# Altium project 110-00315-D_B1-DevKit_1.PrjPcb (part 1 of 5)
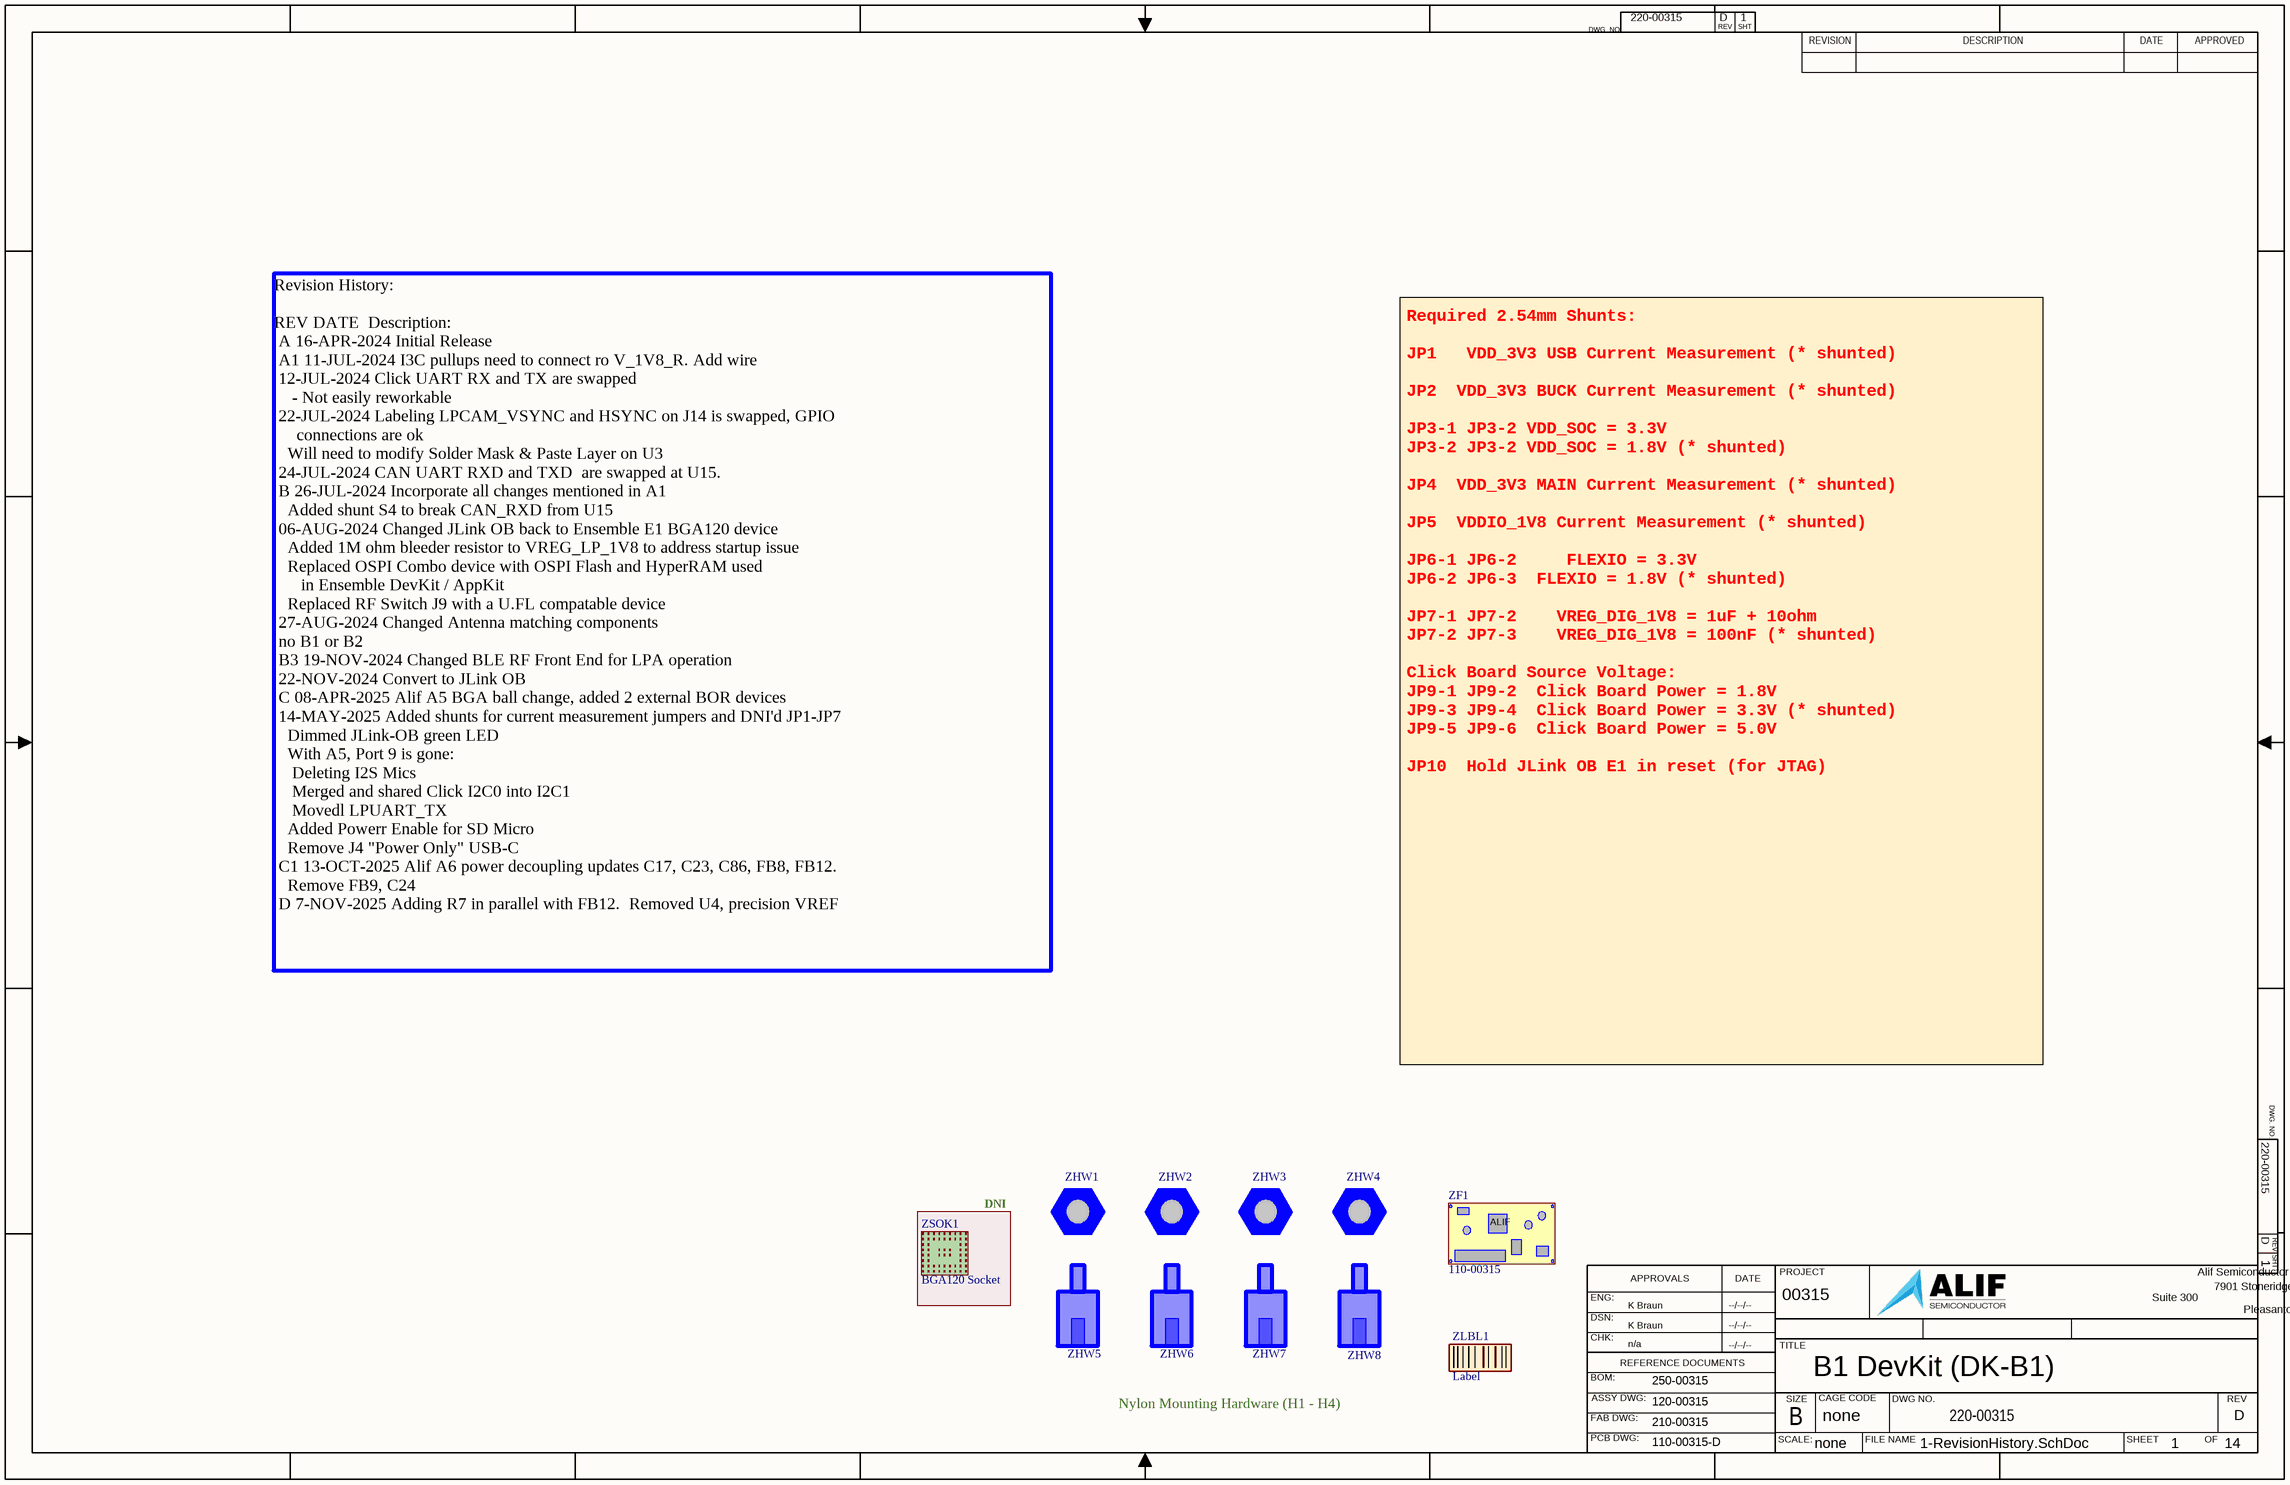
[diagram p0: 1-RevisionHistory.SchDoc]
ASSY_DWG_NO: 120-00315-D; CAGE_CODE: none; CheckedBy: n/a; CHK_APP_DATE: 11/09/25; DOC_NO_ASSY_DWG: 120-00315; DOC_NO_BOM: 250-00315; DOC_NO_FAB_DWG: 210-00315; DOC_NO_SCH_DWG: 220-00315; DOC_REV: D; DrawnBy: K Braun; DSN_APP_DATE: 11/09/25; ENG_APP_DATE: 11/09/25; Engineer: K Braun; Fab_DWG_NO: 110-00315; Marketing Name: DK-B1; Name-Company: ALIF SEMICONDUCTOR; Name-Project: B1 DevKit (DK-B1); PCB_DWG_NO: 110-00315-D; PROJECT: 00315; Revision: D; SheetTotal: 14; title: B1 DevKit (DK-B1)
14 sheets, 430 parts. Net scope: flat (ports and power ports of the same name join across sheets).
Board file: 110-00315-D_B1-DevKit.PcbDoc
Sheets:
  1-RevisionHistory.SchDoc
  2-PowerInput.SchDoc
  3-CPUPower.SchDoc
  4-CPUMipiXo.SchDoc
  5-Memory.SchDoc
  6-CODEC.SchDoc
  7-IO_Headers.SchDoc
  8-SensorsAndJTAG.SchDoc
  9-MIPI.SchDoc
  10-Click.SchDoc
  11-CPU_GPIO.SchDoc
  12-JLINK_1.SchDoc
  13-JLINK_2.SchDoc
  14-Cypress.SchDoc

## Sheet 1-RevisionHistory.SchDoc: B1 DevKit (DK-B1)
size 431 x 279 mm; Organization: ORGANIZATION; Address1: ADDRESS 1; Address2: ADDRESS 2; Address3: ADDRESS 3; Address4: ADDRESS 4; DocumentNumber: 1; Revision: -; SheetNumber: 1; SheetTotal: 14; ENG_APP_DATE: --/--/--; DSN_APP_DATE: --/--/--; CHK_APP_DATE: --/--/--

### Parts
ZF1  110-00315  (mechanical)
ZHW1  #4-40  (value not drawn)  (mechanical)
ZHW2  #4-40  (value not drawn)  (mechanical)
ZHW3  #4-40  (value not drawn)  (mechanical)
ZHW4  #4-40  (value not drawn)  (mechanical)
ZHW5  #4-40 1/4"  (value not drawn)  (mechanical)
ZHW6  #4-40 1/4"  (value not drawn)  (mechanical)
ZHW7  #4-40 1/4"  (value not drawn)  (mechanical)
ZHW8  #4-40 1/4"  (value not drawn)  (mechanical)
ZLBL1  Label  (mechanical)
ZSOK1  BGA120 Socket  (mechanical)

### Blocks framed on the sheet
DNI: ZSOK1

### Notes on the sheet
- Revision History:
  REV	DATE		Description:
  A	16-APR-2024	Initial Release
  A1	11-JUL-2024	I3C pullups need to connect ro V_1V8_R. Add wire
  12-JUL-2024	Click UART RX and TX are swapped
  - Not easily reworkable
  22-JUL-2024	Labeling LPCAM_VSYNC and HSYNC on J14 is swapped, GPIO
  connections are ok
  Will need to modify Solder Mask & Paste Layer on U3
  24-JUL-2024	CAN UART RXD and TXD  are swapped at U15.
  B	26-JUL-2024	Incorporate all changes mentioned in A1
  Added shunt S4 to break CAN_RXD from U15
  06-AUG-2024	Changed JLink OB back to Ensemble E1 BGA120 device
  Added 1M ohm bleeder resistor to VREG_LP_1V8 to address startup issue
  Replaced OSPI Combo device with OSPI Flash and HyperRAM used
  in Ensemble DevKit / AppKit
  Replaced RF Switch J9 with a U.FL compatable device
  27-AUG-2024	Changed Antenna matching components
  no B1 or B2
  B3	19-NOV-2024	Changed BLE RF Front End for LPA operation
  22-NOV-2024	Convert to JLink OB
  C	08-APR-2025	Alif A5 BGA ball change, added 2 external BOR devices
  14-MAY-2025	Added shunts for current measurement jumpers and DNI'd JP1-JP7
  Dimmed JLink-OB green LED
  With A5, Port 9 is gone:
  Deleting I2S Mics
  Merged and shared Click I2C0 into I2C1
  Movedl LPUART_TX
  Added Powerr Enable for SD Micro
  Remove J4 "Power Only" USB-C
  C1	13-OCT-2025	Alif A6 power decoupling updates C17, C23, C86, FB8, FB12.
  Remove FB9, C24
  D	7-NOV-2025	Adding R7 in parallel with FB12.  Removed U4, precision VREF
- Required 2.54mm Shunts:
  JP1 		VDD_3V3 USB Current Measurement (* shunted)
  JP2		VDD_3V3 BUCK Current Measurement (* shunted)
  JP3-1 JP3-2	VDD_SOC = 3.3V
  JP3-2 JP3-2	VDD_SOC = 1.8V (* shunted)
  JP4		VDD_3V3 MAIN Current Measurement (* shunted)
  JP5		VDDIO_1V8 Current Measurement (* shunted)
  JP6-1 JP6-2     FLEXIO = 3.3V
  JP6-2 JP6-3 	FLEXIO = 1.8V (* shunted)
  JP7-1 JP7-2   	VREG_DIG_1V8 = 1uF + 10ohm
  JP7-2 JP7-3   	VREG_DIG_1V8 = 100nF (* shunted)
  Click Board Source Voltage:
  JP9-1 JP9-2 	Click Board Power = 1.8V
  JP9-3 JP9-4 	Click Board Power = 3.3V (* shunted)
  JP9-5 JP9-6 	Click Board Power = 5.0V
  JP10		Hold JLink OB E1 in reset (for JTAG)
- Nylon Mounting Hardware (H1 - H4)
- DWG. NO.
- REV
- SHT
- REVISION
- DESCRIPTION
- DATE
- APPROVED
- ENG:
- APPROVALS
- PROJECT
- Suite 300
- Alif Semiconductor
- 7901 Stoneridge Drive
- DSN:
- CHK:
- REFERENCE DOCUMENTS
- TITLE
- Pleasanton, CA 94588  USA
- BOM:
- FAB DWG:
- PCB DWG:
- ASSY DWG:
- SCALE:
- SIZE
- B
- CAGE CODE
- FILE NAME
- DWG NO.
- SHEET
- OF
- none
- (in symbol PCB_FAB) ALIF

### Library data of the parts
ZF1 = PCB_FAB: Printed Circuit Board  Fabrication; Manufacturer 1: Alif Semi; Manufacturer Part Number 1: 110-00315-D; Manufacturer 2: *; Manufacturer Part Number 2: *; Manufacturer 3: *; Manufacturer Part Number 3: *
ZHW1-ZHW4 = HW_NUT: Hardware, Nut, Hex, #4-40 x 1/8" H, 1/4" Dia, Nylon; Manufacturer 1: Essentra Comp; Manufacturer Part Number 1: 0400440HNS; Manufacturer 2: *; Manufacturer Part Number 2: *; Manufacturer 3: *; Manufacturer Part Number 3: *
ZHW5-ZHW8 = HW_STANDOFF_MF: Hardware, Standoff, Hex Male-Female, #4-40 x 1/4" H, 1/4" Dia, Nylon; Manufacturer 1: Keystone; Manufacturer Part Number 1: 4800; Manufacturer 2: Essentra Comp; Manufacturer Part Number 2: 36440MF025; Manufacturer 3: RAF Elec; Manufacturer Part Number 3: 4530-440-N
ZLBL1 = MOD_LABEL_GENERIC: Label, UPC, Agency and Lot Num, Low Cost Balletto DevKit; Manufacturer 1: Alif; Manufacturer Part Number 1: -need a p/n-; Manufacturer 2: *; Manufacturer Part Number 2: *; Manufacturer 3: *; Manufacturer Part Number 3: *
ZSOK1 = MOD_SOCKET: DNI, Socket, IC Test, BGA120; Manufacturer 1: TwinSocket; Manufacturer Part Number 1: TIUI2050-00120-01; Manufacturer 2: *; Manufacturer Part Number 2: *; Manufacturer 3: *; Manufacturer Part Number 3: *

## Sheet 2-PowerInput.SchDoc: B1 DevKit (DK-B1)
size 431 x 279 mm; Organization: ORGANIZATION; Address1: ADDRESS 1; Address2: ADDRESS 2; Address3: ADDRESS 3; Address4: ADDRESS 4; DocumentNumber: 2; Revision: -; SheetNumber: 2; SheetTotal: 14; ENG_APP_DATE: --/--/--; DSN_APP_DATE: --/--/--; CHK_APP_DATE: --/--/--
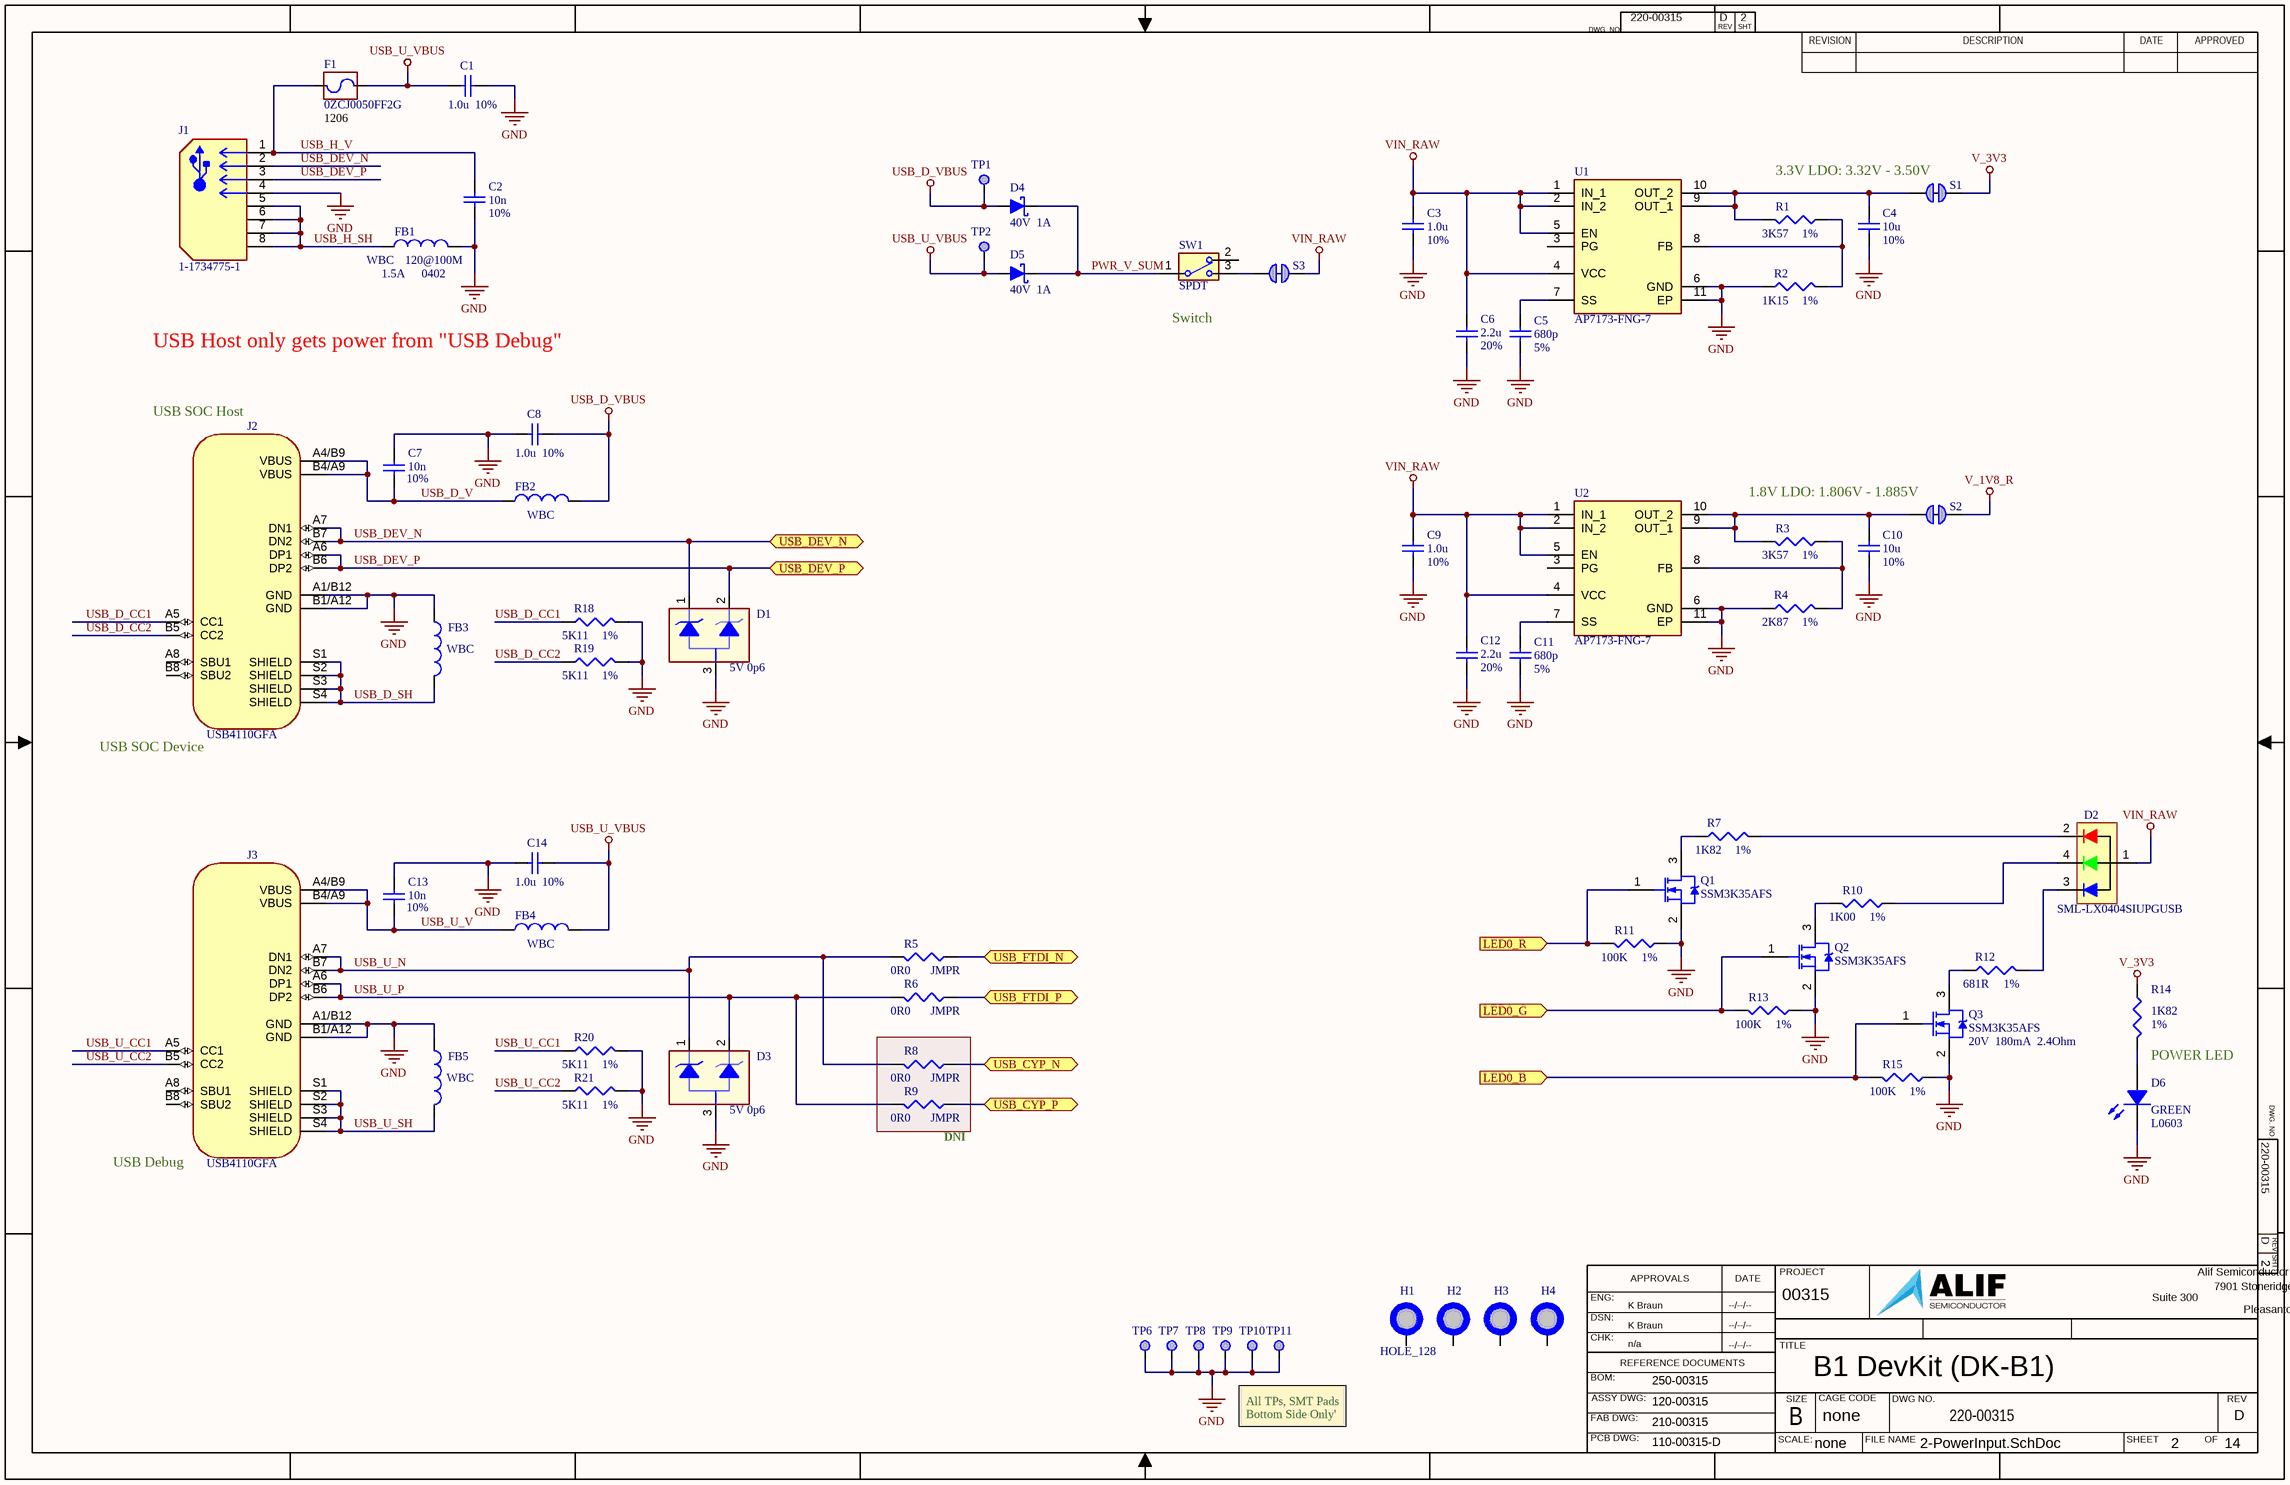
[diagram p1: 2-PowerInput.SchDoc]

### Parts
C1  value 1.0u  Tolerance: 10%  [CAPC0402-01]  (hidden comment: Cap)
C2  value 10n  Tolerance: 10%  [CAPC0402-01]  (hidden comment: Cap)
C3  value 1.0u  Tolerance: 10%  [CAPC0402-01]  (hidden comment: Cap)
C4  value 10u  Tolerance: 10%  [CAPC0402-01]  (hidden comment: Cap)
C5  value 680p  Tolerance: 5%  [CAPC0402-01]  (hidden comment: Cap)
C6  value 2.2u  Tolerance: 20%  [CAPC0402-01]  (hidden comment: Cap_225M25VX5R0402_1)
C7  value 10n  Tolerance: 10%  [CAPC0402-01]  (hidden comment: Cap)
C8  value 1.0u  Tolerance: 10%  [CAPC0402-01]  (hidden comment: Cap)
C9  value 1.0u  Tolerance: 10%  [CAPC0402-01]  (hidden comment: Cap)
C10  value 10u  Tolerance: 10%  [CAPC0402-01]  (hidden comment: Cap)
C11  value 680p  Tolerance: 5%  [CAPC0402-01]  (hidden comment: Cap)
C12  value 2.2u  Tolerance: 20%  [CAPC0402-01]  (hidden comment: Cap_225M25VX5R0402_1)
C13  value 10n  Tolerance: 10%  [CAPC0402-01]  (hidden comment: Cap)
C14  value 1.0u  Tolerance: 10%  [CAPC0402-01]  (hidden comment: Cap)
D1  value 5V 0p6  [SOT-23_DBZ_TEX]  (hidden comment: Zener)
D2  SML-LX0404SIUPGUSB  [LED_SML-LX0404_LUM]
D3  value 5V 0p6  [SOT-23_DBZ_TEX]  (hidden comment: Zener)
D4  value 40V  1A  [SOD123F_NXP]  (hidden comment: D Schottky)
D5  value 40V  1A  [SOD123F_NXP]  (hidden comment: D Schottky)
D6  value GREEN  PackageReference: L0603  [LED_0603-GRN_AK]  (hidden comment: D LED2)
F1  0ZCJ0050FF2G  Footprint: 1206  [RESC3216X125N_1206]
FB1  value WBC  Impedance: 120@100M  PCB_Footprint: 0402  RMS_Current: 1.5A  [FB_0402_MuRata_as_R0402]  (hidden comment: Ind_WBC_1A5_120@100M0402_1)
FB2  value WBC  [FB_0402_MuRata_as_R0402]  (hidden comment: Ind_WBC_1A5_120@100M0402_1)
FB3  value WBC  [FB_0402_MuRata_as_R0402]  (hidden comment: Ind_WBC_1A5_120@100M0402_1)
FB4  value WBC  [FB_0402_MuRata_as_R0402]  (hidden comment: Ind_WBC_1A5_120@100M0402_1)
FB5  value WBC  [FB_0402_MuRata_as_R0402]  (hidden comment: Ind_WBC_1A5_120@100M0402_1)
H1  HOLE_128  [Hole_#4]  (no BOM)
H2  HOLE_128  [Hole_#4]  (value not drawn)  (no BOM)
H3  HOLE_128  [Hole_#4]  (value not drawn)  (no BOM)
H4  HOLE_128  [Hole_#4]  (value not drawn)  (no BOM)
J1  1-1734775-1  [614004134726]
J2  USB4110GFA  [CONN_USB_C_GCT_USB4110GFA]
J3  USB4110GFA  [CONN_USB_C_GCT_USB4110GFA]
Q1  Manufacturer Part Number 1: SSM3K35AFS  [SC75_SSM_TOS-L]  (hidden comment: NMOS-2_SOT)
Q2  Manufacturer Part Number 1: SSM3K35AFS  [SC75_SSM_TOS-L]  (hidden comment: NMOS-2_SOT)
Q3  value 20V  180mA  2.4Ohm  Manufacturer Part Number 1: SSM3K35AFS  [SC75_SSM_TOS-L]  (hidden comment: NMOS-2_SOT)
R1  value 3K57  Tolerance: 1%  [RESC0402-01]  (hidden comment: Res3)
R2  value 1K15  Tolerance: 1%  [RESC0402-01]  (hidden comment: Res3)
R3  value 3K57  Tolerance: 1%  [RESC0402-01]  (hidden comment: Res3)
R4  value 2K87  Tolerance: 1%  [RESC0402-01]  (hidden comment: Res3)
R5  value 0R0  Tolerance: JMPR  [RESC0402-01]  (hidden comment: Res3)
R6  value 0R0  Tolerance: JMPR  [RESC0402-01]  (hidden comment: Res3)
R7  value 1K82  Tolerance: 1%  [RESC0402-01]  (hidden comment: Res3)
R8  value 0R0  Tolerance: JMPR  [RESC0402-01]  (hidden comment: Res3)
R9  value 0R0  Tolerance: JMPR  [RESC0402-01]  (hidden comment: Res3)
R10  value 1K00  Tolerance: 1%  [RESC0402-01]  (hidden comment: Res3)
R11  value 100K  Tolerance: 1%  [RESC0402-01]  (hidden comment: Res3)
R12  value 681R  Tolerance: 1%  [RESC0402-01]  (hidden comment: Res3)
R13  value 100K  Tolerance: 1%  [RESC0402-01]  (hidden comment: Res3)
R14  value 1K82  Tolerance: 1%  [RESC0402-01]  (hidden comment: Res3)
R15  value 100K  Tolerance: 1%  [RESC0402-01]  (hidden comment: Res3)
R18  value 5K11  Tolerance: 1%  [RESC0402-01]  (hidden comment: Res3)
R19  value 5K11  Tolerance: 1%  [RESC0402-01]  (hidden comment: Res3)
R20  value 5K11  Tolerance: 1%  [RESC0402-01]  (hidden comment: Res3)
R21  value 5K11  Tolerance: 1%  [RESC0402-01]  (hidden comment: Res3)
S1  SolderJumperShorted_Small  [Solderbridge_Shorted]  (value not drawn)  (net tie, no BOM)
S2  SolderJumperShorted_Small  [Solderbridge_Shorted]  (value not drawn)  (net tie, no BOM)
S3  SolderJumperShorted_Small  [Solderbridge_Shorted]  (value not drawn)  (net tie, no BOM)
SW1  SPDT  [SW_450301014042_WRE]
TP1  TP_SMPAD  [TP_30_RND]  (value not drawn)  (no BOM)
TP2  TP_SMPAD  [TP_30_RND]  (value not drawn)  (no BOM)
TP6  TP_SMPAD  [TP_30_RND]  (value not drawn)  (no BOM)
TP7  TP_SMPAD  [TP_30_RND]  (value not drawn)  (no BOM)
TP8  TP_SMPAD  [TP_30_RND]  (value not drawn)  (no BOM)
TP9  TP_SMPAD  [TP_30_RND]  (value not drawn)  (no BOM)
TP10  TP_SMPAD  [TP_30_RND]  (value not drawn)  (no BOM)
TP11  TP_SMPAD  [TP_30_RND]  (value not drawn)  (no BOM)
U1  AP7173-FNG-7  [UDFN3030-10_SON50P300X300X63-11N]
U2  AP7173-FNG-7  [UDFN3030-10_SON50P300X300X63-11N]

### Ports
LED0_B (in), LED0_G (in), LED0_R (in), USB_CYP_N (bidir), USB_CYP_P (bidir), USB_DEV_N (bidir), USB_DEV_P (bidir), USB_FTDI_N (bidir), USB_FTDI_P (bidir)

### Nets
GND: C1.2 C2.1 C3.1 C4.1 C5.1 C6.1 C7.1 C8.1 C9.1 C10.1 C11.1 C12.1 C13.1 C14.1 D1.3(A) D3.3(A) D6.K FB1.2 FB3.1 FB5.1 J1.4 J2.A1/B12(GND) J2.B1/A12(GND) J3.A1/B12(GND) J3.B1/A12(GND) Q1.2(S) Q2.2(S) Q3.2(S) R2.1 R4.1 R11.1 R13.1 R15.1 R18.2 R19.2 R20.2 R21.2 TP6.1 TP7.1 TP8.1 TP9.1 TP10.1 TP11.1 U1.6(GND) U1.11(EP) U2.6(GND) U2.11(EP)
USB_D_VBUS: C8.2 D4.2(A) FB2.2 TP1.1
USB_U_VBUS: C1.1 C14.2 D5.2(A) F1.2 FB4.2 TP2.1
V_1V8_R: S2.2
V_3V3: R14.1 S1.2
VIN_RAW: C3.2 C6.2 C9.2 C12.2 D2.1(A) S3.2 U1.1(IN_1) U1.2(IN_2) U1.4(VCC) U1.5(EN) U2.1(IN_1) U2.2(IN_2) U2.4(VCC) U2.5(EN)
P4_3: Q3.1(G) R15.2 ; port LED0_B
P4_5: Q2.1(G) R13.2 ; port LED0_G
P4_7: Q1.1(G) R11.2 ; port LED0_R
PWR_V_SUM: D4.1(K) D5.1(K) SW1.1(COMMON)
USB_CYP_N: R8.1 ; port USB_CYP_N
USB_CYP_P: R9.1 ; port USB_CYP_P
USB_D_CC1: J2.A5(CC1) R18.1
USB_D_CC2: J2.B5(CC2) R19.1
USB_D_SH: FB3.2 J2.S1(SHIELD) J2.S2(SHIELD) J2.S3(SHIELD) J2.S4(SHIELD)
USB_D_V: C7.2 FB2.1 J2.A4/B9(VBUS) J2.B4/A9(VBUS)
USB_DEV_N: D1.1(K1) J1.2 J2.A7(DN1) J2.B7(DN2) ; port USB_DEV_N
USB_DEV_P: D1.2 J1.3 J2.A6(DP1) J2.B6(DP2) ; port USB_DEV_P
USB_FTDI_N: R5.1 ; port USB_FTDI_N
USB_FTDI_P: R6.1 ; port USB_FTDI_P
USB_H_SH: FB1.1 J1.5 J1.6 J1.7 J1.8
USB_H_V: C2.2 F1.1 J1.1
USB_U_CC1: J3.A5(CC1) R20.1
USB_U_CC2: J3.B5(CC2) R21.1
USB_U_N: D3.1(K1) J3.A7(DN1) J3.B7(DN2) R5.2 R8.2
USB_U_P: D3.2 J3.A6(DP1) J3.B6(DP2) R6.2 R9.2
USB_U_SH: FB5.2 J3.S1(SHIELD) J3.S2(SHIELD) J3.S3(SHIELD) J3.S4(SHIELD)
USB_U_V: C13.2 FB4.1 J3.A4/B9(VBUS) J3.B4/A9(VBUS)
NetC4_2: C4.2 R1.2 S1.1 U1.9(OUT_1) U1.10(OUT_2)
NetC5_2: C5.2 U1.7(SS)
NetC10_2: C10.2 R3.2 S2.1 U2.9(OUT_1) U2.10(OUT_2)
NetC11_2: C11.2 U2.7(SS)
NetD2_2: D2.2(RK) R7.2
NetD2_3: D2.3(BK) R12.2
NetD2_4: D2.4(GK) R10.1
NetD6_A: D6.A R14.2
NetQ1_3: Q1.3(D) R7.1
NetQ2_3: Q2.3(D) R10.2
NetQ3_3: Q3.3(D) R12.1
NetR1_1: R1.1 R2.2 U1.8(FB)
NetR3_1: R3.1 R4.2 U2.8(FB)
NetS3_1: S3.1 SW1.3(NO)

Not connected (* = marked no-connect by the designer): H1 1; H2 1; H3 1; H4 1; J2 A8(SBU1) B8(SBU2); J3 A8(SBU1) B8(SBU2); SW1 2(NC); U1 3(PG); U2 3(PG)

### Notes on the sheet
- (near S1) 3.3V LDO: 3.32V - 3.50V
- USB Host only gets power from "USB Debug"
- (near SW1) Switch
- (near J2) USB SOC Host
- (near S2) 1.8V LDO: 1.806V - 1.885V
- (near J2) USB SOC Device
- (near R14) POWER LED
- (near J3) USB Debug
- (near R9) DNI
- All TPs, SMT Pads
  Bottom Side Only'
- DWG. NO.
- REV
- SHT
- REVISION
- DESCRIPTION
- DATE
- APPROVED
- ENG:
- APPROVALS
- PROJECT
- Suite 300
- Alif Semiconductor
- 7901 Stoneridge Drive
- DSN:
- CHK:
- REFERENCE DOCUMENTS
- TITLE
- Pleasanton, CA 94588  USA
- BOM:
- FAB DWG:
- PCB DWG:
- ASSY DWG:
- SCALE:
- SIZE
- B
- CAGE CODE
- FILE NAME
- DWG NO.
- SHEET
- OF
- none

### Library data of the parts
C1 C3 C8 C9 C14 = Cap: Cap,1.0uF,20%,25V,X5R,0402; Manufacturer 1: TDK; Manufacturer Part Number 1: CGB2A1X5R1E105K033BC; PCB_Footprint: CC0402; Published: 8-Jun-2000; LatestRevisionDate: 17-Jul-2002; LatestRevisionNote: Re-released for DXP Platform.; PackageReference: RAD-0.3; Publisher: Altium Limited; PackageDescription: Radial Cap, Thru-Hole; 2 Leads; 0.3 in Pin Spacing; Max_Height: 0.60mm; Manufacturer 2: Yageo; Manufacturer Part Number 2: CC0402KRX5R8BB105; Manufacturer 3: Murata; Manufacturer Part Number 3: GRM155R61E105KA12D; Type: X5R; Voltage: 25V
C2 C7 C13 = Cap: Cap,10nF,10%,50V,X7R,0402; Manufacturer 1: TDK; Manufacturer Part Number 1: CGA2B3X7R1H103K050BE; PCB_Footprint: CC0402; Published: 8-Jun-2000; LatestRevisionDate: 17-Jul-2002; LatestRevisionNote: Re-released for DXP Platform.; PackageReference: RAD-0.3; Publisher: Altium Limited; PackageDescription: Radial Cap, Thru-Hole; 2 Leads; 0.3 in Pin Spacing; Max_Height: 0.60mm; Manufacturer 2: Samsung; Manufacturer Part Number 2: CL05B103KB5NNNC; Manufacturer 3: Walsin; Manufacturer Part Number 3: 0402B103K500CT; Type: X7R; Voltage: 50V
C4 C10 = Cap: Cap,10uF,20%,10V,X5R,0402; Manufacturer 1: AVX; Manufacturer Part Number 1: 0402ZD106MAT2A; PCB_Footprint: CC0402; Published: 8-Jun-2000; LatestRevisionDate: 17-Jul-2002; LatestRevisionNote: Re-released for DXP Platform.; PackageReference: RAD-0.3; Publisher: Altium Limited; PackageDescription: Radial Cap, Thru-Hole; 2 Leads; 0.3 in Pin Spacing; Max_Height: 0.60mm; Manufacturer 2: Samsung; Manufacturer Part Number 2: CL05A106MP5NUNC; Manufacturer 3: Venkel; Manufacturer Part Number 3: C0402X5R100-106MNP; Type: X5R; Voltage: 10V
C5 C11 = Cap: Cap,680pF,5%,50V,C0G,0402; Manufacturer 1: TDK; Manufacturer Part Number 1: CGA2B2NP01H681J050BA; PCB_Footprint: CC0402; Published: 8-Jun-2000; LatestRevisionDate: 17-Jul-2002; LatestRevisionNote: Re-released for DXP Platform.; PackageReference: RAD-0.3; Publisher: Altium Limited; PackageDescription: Radial Cap, Thru-Hole; 2 Leads; 0.3 in Pin Spacing; Max_Height: 0.60mm; Manufacturer 2: Samsung; Manufacturer Part Number 2: CL05C681JB5NNNC; Manufacturer 3: Walsin; Manufacturer Part Number 3: 0402N681J500CT; Type: C0G; Voltage: 50V
C6 C12 = Cap_225M25VX5R0402_1: Cap,2.2uF,20%,25V,X5R,0402; Manufacturer 1: TDK; Manufacturer Part Number 1: C1005X5R1E225M050BC; PCB_Footprint: CC0402; Published: 8-Jun-2000; LatestRevisionDate: 17-Jul-2002; LatestRevisionNote: Re-released for DXP Platform.; PackageReference: RAD-0.3; Publisher: Altium Limited; PackageDescription: Radial Cap, Thru-Hole; 2 Leads; 0.3 in Pin Spacing; Max_Height: 0.60mm; Type: X5R; Voltage: 25V; Manufacturer 2: Murata; Manufacturer Part Number 2: GRM155R61E225ME11D; Manufacturer 3: Murata; Manufacturer Part Number 3: GRM155R61E225ME15D
D1 D3 = D Zener_2_ComA: Diode,Zener,Dual,Common Anode; Manufacturer 1: Nexpheria; Manufacturer Part Number 1: PESD2USB5UX-TR; Published: 8-Jun-2000; LatestRevisionDate: 17-Jul-2002; LatestRevisionNote: Re-released for DXP Platform.; PackageReference: SOT23-3; Publisher: Altium Limited; PackageDescription: SOT23-3; Code_JEDEC: SOT23-3; Manufacturer 2: Nexpheria; Manufacturer Part Number 2: PESD2USB5UXT-QR; Manufacturer 3: *; Manufacturer Part Number 3: *
D2 = D LED_RGB_CA_1MMc1MM: Diode,LED,RGB, (@2mA) -> R=10mcd & 1.75V, G = 50mcd & 2.75V, B = 20mcd & 2.95V, 0404(1mm x 1mm); Manufacturer 1: Lumex; Published: 8-Jun-2000; LatestRevisionDate: 17-Jul-2002; LatestRevisionNote: Re-released for DXP Platform.; PackageVersion: Feb-2002; PackageReference: 1.0x1.0; Publisher: Altium Limited; PackageDescription: SM LED; 2 Flat Leads; Manufacturer Part Number 1: SML-LX0404SIUPGUSB; Manufacturer 2: *; Manufacturer Part Number 2: *; Manufacturer 3: *; Manufacturer Part Number 3: *
D4 D5 = D Schottky: Diode,Schottky,1A,40V,SOD123; Manufacturer 1: ST; Manufacturer Part Number 1: STPS140ZY; Published: 8-Jun-2000; LatestRevisionDate: 17-Jul-2002; LatestRevisionNote: Re-released for DXP Platform.; PackageReference: SOD123; Publisher: Altium Limited; PackageDescription: SOD123; Code_JEDEC: SOD123; Manufacturer 2: Panjit; Manufacturer Part Number 2: SBA140AS_R1_00001; Manufacturer 3: Nexpheria; Manufacturer Part Number 3: PMEG4010EH,115
D6 = D LED2: Diode,LED,Green 573nm,300mcd @ 20mA,0603; Manufacturer 1: Wurth; Manufacturer Part Number 1: 150060VS86000; Published: 8-Jun-2000; LatestRevisionDate: 17-Jul-2002; LatestRevisionNote: Re-released for DXP Platform.; PackageVersion: Feb-2002; Publisher: Altium Limited; PackageDescription: SM LED; 2 Flat Leads; Manufacturer 2: *; Manufacturer Part Number 2: *; Manufacturer 3: *; Manufacturer Part Number 3: *
F1 = Fuse_PTC_0ZCJ0050FF2G: Fuse,Poly PTC,1A,8V,150mOhm,1206; Mfr_Name: Belfuse; Copyright: Copyright (C) 2022 Ultra Librarian. All rights reserved.; Manufacturer_Part_Number: 0ZCJ0050FF2G; Digi-Key_Part_Number_1: 507-1802-1-ND; Digi-Key_Part_Number_2: 507-1802-2-ND; Digi-Key_Part_Number_3: 507-1802-6-ND; RefDes: RefDes; Manufacturer 1: Belfuse; Manufacturer Part Number 1: 0ZCJ0050FF2G; Manufacturer 2: *; Manufacturer Part Number 2: *; Manufacturer 3: *; Manufacturer Part Number 3: *
FB1 = Ind_WBC_1A5_120@100M0402_1: Ind,WidebandChoke,1.5A,120ohm@100MHz,95mOhm,0402; Manufacturer 1: Murata; Manufacturer Part Number 1: BLM15EG121SN1D; Code_IEC: 1005; DCR: 143m; Tolerance: 30%; Published: 8-Jun-2000; LatestRevisionDate: 29-May-2009; LatestRevisionNote: IPC-7351 Footprint Added.; PackageReference: 0402-A; Publisher: Altium Limited; PackageDescription: Chip Inductor; Code_JEITA: 0402; Sat_Current: *; Type: *; Manufacturer 2: *; Manufacturer Part Number 2: *; Manufacturer 3: *; Manufacturer Part Number 3: *; Max_Height: 0.60mm
FB2-FB5 = Ind_WBC_1A5_120@100M0402_1: Ind,WidebandChoke,1.5A,120ohm@100MHz,95mOhm,0402; Manufacturer 1: Murata; Manufacturer Part Number 1: BLM15EG121SN1D; Code_IEC: 1005; DCR: 143m; Tolerance: 30%; PCB_Footprint: 0402; Published: 8-Jun-2000; LatestRevisionDate: 29-May-2009; LatestRevisionNote: IPC-7351 Footprint Added.; PackageReference: 0402-A; Publisher: Altium Limited; PackageDescription: Chip Inductor; Code_JEITA: 0402; Sat_Current: *; Type: *; Manufacturer 2: *; Manufacturer Part Number 2: *; Manufacturer 3: *; Manufacturer Part Number 3: *; Max_Height: 0.60mm; Impedance: 120@100M; RMS_Current: 1.5A
H1-H4 = HOLE_128: Hole, #4,--not a BOM item--; PCB_Footprint: TP_PAD1
J1 = Conn_1-1734775-1: Conn,USB 2.0, Type A Recept,4 Pos, R/A; Mfr_Name: TE Connectivity; Type: DEV; Copyright: Copyright (C) 2022 Ultra Librarian. All rights reserved.; Manufacturer_Part_Number: 1-1734775-1; Digi-Key_Part_Number_1: A108852-ND; RefDes: RefDes; Manufacturer 1: TE Connectivity; Manufacturer Part Number 1: 1-1734775-1; Manufacturer 2: *; Manufacturer Part Number 2: *; Manufacturer 3: *; Manufacturer Part Number 3: *
J2 J3 = CONN_USB_C_SMT_USB4110GFA: CONN,USB-C, USB 2.0 Receptacle Connector 24 (16+8 Dummy) Position Surface Mount, Right Angle; Manufacturer 1: GCT; SnapEDA_Link: https://www.snapeda.com/parts/USB4110GFA/Global+Connector+Technology/view-part/?ref=snap; Package: None; Value: *; Manufacturer Part Number 1: USB4110GFA; Manufacturer 2: Linkplex; Manufacturer Part Number 2: LUB-C123D-007-G-19
Q1 Q2 = NMOS-2_SOT: MOSFET,N-CH,20V,250mA,1.1Ohm,SOT-23; Manufacturer 1: Toshiba; Note: Pin 2 is electrically connected to pin 4.; Value: 20V  180mA  2.4Ohm; Published: 8-Jun-2000; LatestRevisionDate: 17-Jul-2002; LatestRevisionNote: Re-released for DXP Platform.; DatasheetVersion: PD-9.814; PackageVersion: Feb-1997; PackageReference: TO-220AB; Publisher: Altium Limited; PackageDescription: TO, Thru-Hole, Vertical, Heatsink Mounted; 3 In-Line Leads; Pitch 2.54 mm; ComponentLink1Description: Manufacturer Link; ComponentLink1URL: http://www.irf.com/; Manufacturer 2: Rohm; Manufacturer Part Number 2: RUE002N02TL; Manufacturer 3: *; Manufacturer Part Number 3: *
Q3 = NMOS-2_SOT: MOSFET,N-CH,20V,250mA,1.1Ohm,SOT-23; Manufacturer 1: Toshiba; Note: Pin 2 is electrically connected to pin 4.; Published: 8-Jun-2000; LatestRevisionDate: 17-Jul-2002; LatestRevisionNote: Re-released for DXP Platform.; DatasheetVersion: PD-9.814; PackageVersion: Feb-1997; PackageReference: TO-220AB; Publisher: Altium Limited; PackageDescription: TO, Thru-Hole, Vertical, Heatsink Mounted; 3 In-Line Leads; Pitch 2.54 mm; ComponentLink1Description: Manufacturer Link; ComponentLink1URL: http://www.irf.com/; Manufacturer 2: Rohm; Manufacturer Part Number 2: RUE002N02TL; Manufacturer 3: *; Manufacturer Part Number 3: *
R1 R3 = Res3: Res,3K57,1%,100ppm,0402; Manufacturer 1: Stackpol; Manufacturer Part Number 1: RMCF0402FT3K57; Wattage: 63mW; Published: 8-Jun-2000; LatestRevisionDate: 29-May-2009; LatestRevisionNote: IPC-7351 Footprint Added.; PackageReference: RESC0402-01; Publisher: Altium Limited; PackageDescription: Chip Resistor; Voltage: *; Type: Thick Film; Manufacturer 2: Yageo; Manufacturer Part Number 2: RC0402FR-073K57L; Manufacturer 3: *; Manufacturer Part Number 3: *; PCB_Footprint: RESC0402-01
R2 = Res3: Res,1K15,1%,100ppm,0402; Manufacturer 1: Stackpol; Manufacturer Part Number 1: RMCF0402FT1K15; Wattage: 63mW; Published: 8-Jun-2000; LatestRevisionDate: 29-May-2009; LatestRevisionNote: IPC-7351 Footprint Added.; PackageReference: RESC0402-01; Publisher: Altium Limited; PackageDescription: Chip Resistor; Voltage: *; Type: Thick Film; Manufacturer 2: Yageo; Manufacturer Part Number 2: RC0402FR-071K15L; Manufacturer 3: Bourns; Manufacturer Part Number 3: CR0402-FX-1151GLF; PCB_Footprint: RESC0402-01
R4 = Res3: Res,2K87,1%,100ppm,0402; Manufacturer 1: Stackpol; Manufacturer Part Number 1: RMCF0402FT2K87; Wattage: 63mW; Published: 8-Jun-2000; LatestRevisionDate: 29-May-2009; LatestRevisionNote: IPC-7351 Footprint Added.; PackageReference: RESC0402-01; Publisher: Altium Limited; PackageDescription: Chip Resistor; Voltage: *; Type: Thick Film; Manufacturer 2: Yageo; Manufacturer Part Number 2: RC0402FR-072K87L; Manufacturer 3: Bourns; Manufacturer Part Number 3: CR0402-FX-2871GLF; PCB_Footprint: RESC0402-01
R5 R6 = Res3: Res,0R ohm,Jumper,0402; Manufacturer 1: Stackpol; Manufacturer Part Number 1: RMCF0402ZT0R00; Wattage: 63mW; Published: 8-Jun-2000; LatestRevisionDate: 29-May-2009; LatestRevisionNote: IPC-7351 Footprint Added.; PackageReference: RESC0402-01; Publisher: Altium Limited; PackageDescription: Chip Resistor; Voltage: *; Type: Thick Film; Manufacturer 2: Yageo; Manufacturer Part Number 2: RC0402FR-070RL; Manufacturer 3: Panasonic; Manufacturer Part Number 3: ERJ-XGN0R00Y; PCB_Footprint: RESC0402-01
R7 R14 = Res3: Res,1K82,1%,100ppm,0402; Manufacturer 1: Stackpol; Manufacturer Part Number 1: RMCF0402FT1K82; Wattage: 63mW; Published: 8-Jun-2000; LatestRevisionDate: 29-May-2009; LatestRevisionNote: IPC-7351 Footprint Added.; PackageReference: RESC0402-01; Publisher: Altium Limited; PackageDescription: Chip Resistor; Voltage: *; Type: Thick Film; Manufacturer 2: Yageo; Manufacturer Part Number 2: RC0402FR-071K82L; Manufacturer 3: Bourns; Manufacturer Part Number 3: CR0402-FX-1821GLF; PCB_Footprint: RESC0402-01
R8 R9 = Res3: DNI,Res,0R ohm,Jumper,0402; Manufacturer 1: Stackpol; Manufacturer Part Number 1: RMCF0402ZT0R00; Wattage: 63mW; Published: 8-Jun-2000; LatestRevisionDate: 29-May-2009; LatestRevisionNote: IPC-7351 Footprint Added.; PackageReference: RESC0402-01; Publisher: Altium Limited; PackageDescription: Chip Resistor; Voltage: *; Type: Thick Film; Manufacturer 2: Yageo; Manufacturer Part Number 2: RC0402FR-070RL; Manufacturer 3: Panasonic; Manufacturer Part Number 3: ERJ-XGN0R00Y; PCB_Footprint: RESC0402-01
R10 = Res3: Res,1K00,1%,100ppm,0402; Manufacturer 1: Stackpol; Manufacturer Part Number 1: RMCF0402FT1K; Wattage: 63mW; Published: 8-Jun-2000; LatestRevisionDate: 29-May-2009; LatestRevisionNote: IPC-7351 Footprint Added.; PackageReference: RESC0402-01; Publisher: Altium Limited; PackageDescription: Chip Resistor; Voltage: *; Type: Thick Film; Manufacturer 2: Yageo; Manufacturer Part Number 2: RC0402FR-071KL; Manufacturer 3: Bourns; Manufacturer Part Number 3: CR0402-FX-1001GLF; PCB_Footprint: RESC0402-01
R11 R13 R15 = Res3: Res,100K,1%,100ppm,0402; Manufacturer 1: Stackpol; Manufacturer Part Number 1: RMCF0402FT100K; Wattage: 63mW; Published: 8-Jun-2000; LatestRevisionDate: 29-May-2009; LatestRevisionNote: IPC-7351 Footprint Added.; PackageReference: RESC0402-01; Publisher: Altium Limited; PackageDescription: Chip Resistor; Voltage: *; Type: Thick Film; Manufacturer 2: Yageo; Manufacturer Part Number 2: RC0402FR-07100KL; Manufacturer 3: Bourns; Manufacturer Part Number 3: CR0402-FX-1003GLF; PCB_Footprint: RESC0402-01
R12 = Res3: Res,681R,1%,100ppm,0402; Manufacturer 1: Stackpol; Manufacturer Part Number 1: RMCF0402FT681R; Wattage: 63mW; Published: 8-Jun-2000; LatestRevisionDate: 29-May-2009; LatestRevisionNote: IPC-7351 Footprint Added.; PackageReference: RESC0402-01; Publisher: Altium Limited; PackageDescription: Chip Resistor; Voltage: *; Type: Thick Film; Manufacturer 2: Yageo; Manufacturer Part Number 2: RC0402FR-07681RL; Manufacturer 3: Bourns; Manufacturer Part Number 3: CR0402-FX-6810GLF; PCB_Footprint: RESC0402-01
R18-R21 = Res3: Res,5K11,1%,100ppm,0402; Manufacturer 1: KOA; Manufacturer Part Number 1: RK73H1ETTP5111F; Wattage: 63mW; Published: 8-Jun-2000; LatestRevisionDate: 29-May-2009; LatestRevisionNote: IPC-7351 Footprint Added.; PackageReference: RESC0402-01; Publisher: Altium Limited; PackageDescription: Chip Resistor; Voltage: *; Type: Thick Film; Manufacturer 2: Yageo; Manufacturer Part Number 2: RC0402FR-075K11L; Manufacturer 3: Bourns; Manufacturer Part Number 3: CR0402-FX-5111GLF; PCB_Footprint: RESC0402-01
S1-S3 = SolderJumperShorted_Small: DNI,Solderable Jumper,Shorted; Wattage: 63mW; PCB_Footprint: SSHORTED; Published: 8-Jun-2000; LatestRevisionDate: 29-May-2009; LatestRevisionNote: IPC-7351 Footprint Added.; PackageReference: J1-0603; Publisher: Altium Limited; PackageDescription: Chip Resistor; Voltage: *; Type: Thick Film; Manufacturer 1: *; Manufacturer Part Number 1: *; Manufacturer 2: *; Manufacturer Part Number 2: *; Manufacturer 3: *; Manufacturer Part Number 3: *; Tolerance: *; Value: *
SW1 = SW-SPDT_Vert-3P: Switch,SPDT, 12V, 500mA, Non-Shorting, 3 Pin PCB Vertical; Manufacturer 1: Wurth; Manufacturer Part Number 1: 450301014042; Value: SPDT-3Pin; Published: 24-Mar-1999; LatestRevisionDate: 17-Jul-2002; LatestRevisionNote: Re-released for DXP Platform.; PackageReference: SPDT-5; Publisher: Altium Limited; PackageDescription: Switch; 2 Leads; Manufacturer 2: EAO; Manufacturer Part Number 2: 09.03201.02; Manufacturer 3: NKK; Manufacturer Part Number 3: SM0320102
TP1 TP2 TP6-TP11 = TP_SMPAD: Test Point, SMT Pad,--not a BOM item--; PCB_Footprint: TP_PAD1
U1 U2 = IC_LDO_AP7173-FNG-7: IC, LDO,Adj 0.8V - 3.3V,1.5A,UDFN3030-10; Manufacturer 1: Diodes Incorporated; Datasheet Link: https://www.diodes.com/assets/Datasheets/AP7173.pdf; Height: 0.63mm; Manufacturer Part Number 1: AP7173-FNG-7; Manufacturer 2: TI; Manufacturer Part Number 2: TPS74801DRCR; Manufacturer 3: OnSemi; Manufacturer Part Number 3: NCP59748MN1ADJTBG

## Sheet 3-CPUPower.SchDoc: B1 DevKit (DK-B1)
size 431 x 279 mm; Organization: ORGANIZATION; Address1: ADDRESS 1; Address2: ADDRESS 2; Address3: ADDRESS 3; Address4: ADDRESS 4; DocumentNumber: 3; Revision: -; SheetNumber: 3; SheetTotal: 14; ENG_APP_DATE: --/--/--; DSN_APP_DATE: --/--/--; CHK_APP_DATE: --/--/--
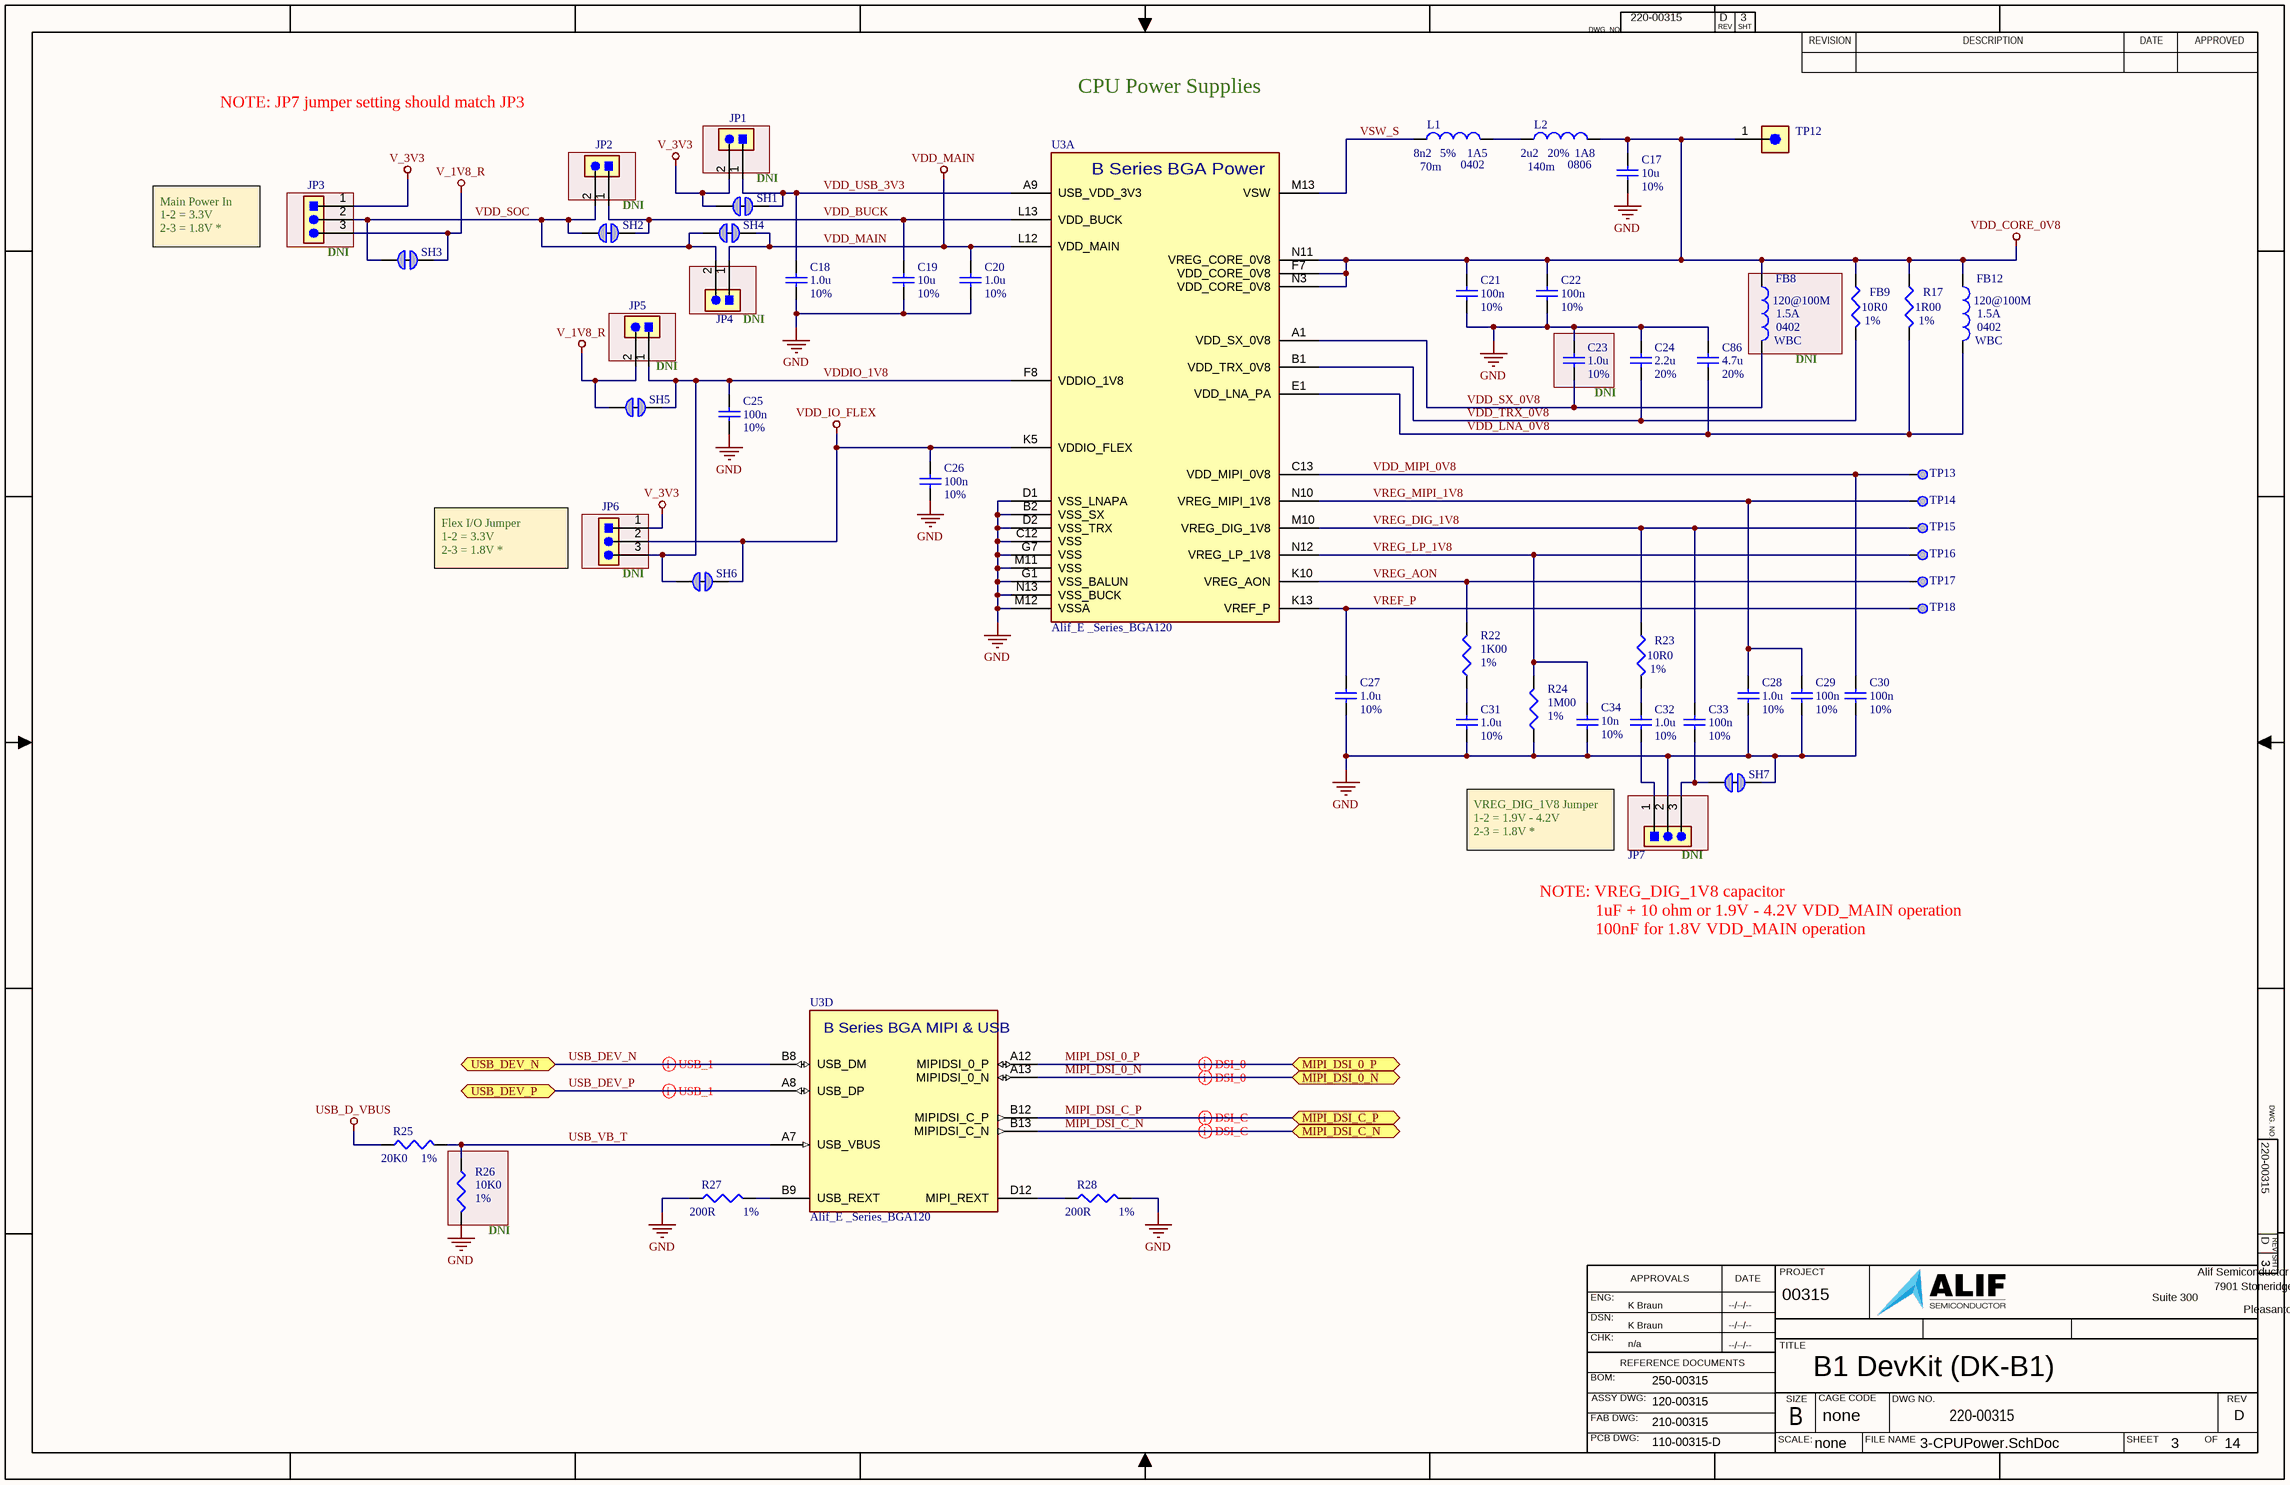
[diagram p2: 3-CPUPower.SchDoc]

### Parts
C17  value 10u  Tolerance: 10%  [CAPC0402-01]  (hidden comment: Cap)
C18  value 1.0u  Tolerance: 10%  [CAPC0402-01]  (hidden comment: Cap)
C19  value 10u  Tolerance: 10%  [CAPC0402-01]  (hidden comment: Cap)
C20  value 1.0u  Tolerance: 10%  [CAPC0402-01]  (hidden comment: Cap)
C21  value 100n  Tolerance: 10%  [CAPC0402-01]  (hidden comment: Cap)
C22  value 100n  Tolerance: 10%  [CAPC0402-01]  (hidden comment: Cap)
C23  value 1.0u  Tolerance: 10%  [CAPC0402-01]  (hidden comment: Cap)
C24  value 2.2u  Tolerance: 20%  [CAPC0402-01]  (hidden comment: Cap_225M25VX5R0402_1)
C25  value 100n  Tolerance: 10%  [CAPC0402-01]  (hidden comment: Cap)
C26  value 100n  Tolerance: 10%  [CAPC0402-01]  (hidden comment: Cap)
C27  value 1.0u  Tolerance: 10%  [CAPC0402-01]  (hidden comment: Cap)
C28  value 1.0u  Tolerance: 10%  [CAPC0402-01]  (hidden comment: Cap)
C29  value 100n  Tolerance: 10%  [CAPC0402-01]  (hidden comment: Cap)
C30  value 100n  Tolerance: 10%  [CAPC0402-01]  (hidden comment: Cap)
C31  value 1.0u  Tolerance: 10%  [CAPC0402-01]  (hidden comment: Cap)
C32  value 1.0u  Tolerance: 10%  [CAPC0402-01]  (hidden comment: Cap)
C33  value 100n  Tolerance: 10%  [CAPC0402-01]  (hidden comment: Cap)
C34  value 10n  Tolerance: 10%  [CAPC0402-01]  (hidden comment: Cap)
C86  value 4.7u  Tolerance: 20%  [CAPC0402-01]  (hidden comment: Cap)
FB8  value WBC  Impedance: 120@100M  PCB_Footprint: 0402  RMS_Current: 1.5A  [FB_0402_MuRata_as_R0402]  (hidden comment: Ind_WBC_1A5_120@100M0402_1)
FB9  value 10R0  Tolerance: 1%  [RESC0402-01]  (hidden comment: Res3)
FB12  value WBC  Impedance: 120@100M  PCB_Footprint: 0402  RMS_Current: 1.5A  [FB_0402_MuRata_as_R0402]  (hidden comment: Ind_WBC_1A5_120@100M0402_1)
JP1  TSW-102-07-G-S  [CONN_77311-146-02LF_AMP_HDR_1x2_2.5MM_STRT_no#D]  (value not drawn)
JP2  TSW-102-07-G-S  [CONN_77311-146-02LF_AMP_HDR_1x2_2.5MM_STRT_no#D]  (value not drawn)
JP3  TSW-103-07-G-S  [CONN_HDR_1X3_STRT_0.100_no3D]  (value not drawn)
JP4  TSW-102-07-G-S  [CONN_77311-146-02LF_AMP_HDR_1x2_2.5MM_STRT_no#D]  (value not drawn)
JP5  TSW-102-07-G-S  [CONN_77311-146-02LF_AMP_HDR_1x2_2.5MM_STRT_no#D]  (value not drawn)
JP6  TSW-103-07-G-S  [CONN_HDR_1X3_STRT_0.100_no3D]  (value not drawn)
JP7  TSW-103-07-G-S  [CONN_HDR_1X3_STRT_0.100_no3D]  (value not drawn)
L1  value 8n2  PCB_Footprint: 0402  DCR: 70m  RMS_Current: 1A5  Tolerance: 5%  [IND_WE-KI_0402]  (hidden comment: Inductor)
L2  value 2u2  PCB_Footprint: 0806  DCR: 140m  RMS_Current: 1A8  Tolerance: 20%  [IND_0806_2016_SAM]  (hidden comment: Inductor)
R17  value 1R00  Tolerance: 1%  [RESC0402-01]  (hidden comment: Res3)
R22  value 1K00  Tolerance: 1%  [RESC0402-01]  (hidden comment: Res3)
R23  value 10R0  Tolerance: 1%  [RESC0402-01]  (hidden comment: Res3)
R24  value 1M00  Tolerance: 1%  [RESC0402-01]  (hidden comment: Res3)
R25  value 20K0  Tolerance: 1%  [RESC0402-01]  (hidden comment: Res3)
R26  value 10K0  Tolerance: 1%  [RESC0402-01]  (hidden comment: Res3)
R27  value 200R  Tolerance: 1%  [RESC0402-01]  (hidden comment: Res3)
R28  value 200R  Tolerance: 1%  [RESC0402-01]  (hidden comment: Res3)
SH1  SolderJumperShorted_Small  [Solderbridge_Shorted]  (value not drawn)  (net tie, no BOM)
SH2  SolderJumperShorted_Small  [Solderbridge_Shorted]  (value not drawn)  (net tie, no BOM)
SH3  SolderJumperShorted_Small  [Solderbridge_Shorted]  (value not drawn)  (net tie, no BOM)
SH4  SolderJumperShorted_Small  [Solderbridge_Shorted]  (value not drawn)  (net tie, no BOM)
SH5  SolderJumperShorted_Small  [Solderbridge_Shorted]  (value not drawn)  (net tie, no BOM)
SH6  SolderJumperShorted_Small  [Solderbridge_Shorted]  (value not drawn)  (net tie, no BOM)
SH7  SolderJumperShorted_Small  [Solderbridge_Shorted]  (value not drawn)  (net tie, no BOM)
TP12  TSW-101-07-G-S  [CONN_77311-146-01LF_AMP_HDR_1X1_2.5MM_STRT_No3D]  (value not drawn)
TP13  TP_SMPAD  [TP_30_RND]  (value not drawn)  (no BOM)
TP14  TP_SMPAD  [TP_30_RND]  (value not drawn)  (no BOM)
TP15  TP_SMPAD  [TP_30_RND]  (value not drawn)  (no BOM)
TP16  TP_SMPAD  [TP_30_RND]  (value not drawn)  (no BOM)
TP17  TP_SMPAD  [TP_30_RND]  (value not drawn)  (no BOM)
TP18  TP_SMPAD  [TP_30_RND]  (value not drawn)  (no BOM)
U3  Alif_E _Series_BGA120  [BGA120_socket-NO_SOCK_3D]  (parts A,D of 4)

### Ports
MIPI_DSI_0_N (bidir), MIPI_DSI_0_P (bidir), MIPI_DSI_C_N (bidir), MIPI_DSI_C_P (bidir), USB_DEV_N (bidir), USB_DEV_P (bidir)

### Nets
GND: C17.1 C18.1 C19.1 C20.1 C21.1 C22.1 C23.2 C24.2 C25.1 C26.1 C27.1 C28.1 C29.1 C30.1 C31.1 C34.2 C86.2 JP7.2 R24.1 R26.2 R27.1 R28.2 SH7.2 U3.B2(VSS_SX) U3.C12(VSS) U3.D1(VSS_LNAPA) U3.D2(VSS_TRX) U3.G1(VSS_BALUN) U3.G7(VSS) U3.M11(VSS) U3.M12(VSSA) U3.N13(VSS_BUCK)
USB_D_VBUS: R25.1
V_1V8_R: JP3.3 JP5.2 SH3.2 SH5.1
V_3V3: JP1.2 JP3.1 JP6.1 SH1.1
VDD_CORE_0V8: C17.2 C21.2 C22.2 FB8.1 FB9.2 FB12.1 L2.2 R17.2 TP12.1 U3.F7(VDD_CORE_0V8) U3.N3(VDD_CORE_0V8) U3.N11(VREG_CORE_0V8)
VDD_IO_FLEX: C26.2 JP6.2 SH6.2 U3.K5(VDDIO_FLEX)
VDD_MAIN: C20.2 JP4.1 SH4.2 U3.L12(VDD_MAIN)
MIPI_DSI_0_N: U3.A13(MIPIDSI_0_N) ; port MIPI_DSI_0_N
MIPI_DSI_0_P: U3.A12(MIPIDSI_0_P) ; port MIPI_DSI_0_P
MIPI_DSI_C_N: U3.B13(MIPIDSI_C_N) ; port MIPI_DSI_C_N
MIPI_DSI_C_P: U3.B12(MIPIDSI_C_P) ; port MIPI_DSI_C_P
USB_DEV_N: U3.B8(USB_DM) ; port USB_DEV_N
USB_DEV_P: U3.A8(USB_DP) ; port USB_DEV_P
USB_VB_T: R25.2 R26.1 U3.A7(USB_VBUS)
VDD_BUCK: C19.2 JP2.1 SH2.2 U3.L13(VDD_BUCK)
VDD_LNA_0V8: C86.1 FB12.2 R17.1 U3.E1(VDD_LNA_PA)
VDD_MIPI_0V8: C30.2 TP13.1 U3.C13(VDD_MIPI_0V8)
VDD_SOC: JP2.2 JP3.2 JP4.2 SH2.1 SH3.1 SH4.1
VDD_SX_0V8: C23.1 FB8.2 U3.A1(VDD_SX_0V8)
VDD_TRX_0V8: C24.1 FB9.1 U3.B1(VDD_TRX_0V8)
VDD_USB_3V3: C18.2 JP1.1 SH1.2 U3.A9(USB_VDD_3V3)
VDDIO_1V8: C25.2 JP5.1 JP6.3 SH5.2 SH6.1 U3.F8(VDDIO_1V8)
VREF_P: C27.2 TP18.1 U3.K13(VREF_P)
VREG_AON: R22.2 TP17.1 U3.K10(VREG_AON)
VREG_DIG_1V8: C33.2 R23.2 TP15.1 U3.M10(VREG_DIG_1V8)
VREG_LP_1V8: C34.1 R24.2 TP16.1 U3.N12(VREG_LP_1V8)
VREG_MIPI_1V8: C28.2 C29.2 TP14.1 U3.N10(VREG_MIPI_1V8)
VSW_S: L1.1 U3.M13(VSW)
NetC31_2: C31.2 R22.1
NetC32_1: C32.1 JP7.1
NetC32_2: C32.2 R23.1
NetC33_1: C33.1 JP7.3 SH7.1
NetL1_2: L1.2 L2.1
NetR27_2: R27.2 U3.B9(USB_REXT)
NetR28_1: R28.1 U3.D12(MIPI_REXT)

### Layout directives
differential pair; differential pair class MIPI_DSI_0_: MIPI_DSI_0_N, MIPI_DSI_0_P
differential pair; differential pair class MIPI_DSI_C_: MIPI_DSI_C_N, MIPI_DSI_C_P
differential pair; differential pair class USB_DEV_: USB_DEV_N, USB_DEV_P

### Notes on the sheet
- CPU Power Supplies
- NOTE: JP7 jumper setting should match JP3
- DNI
- Main Power In
  1-2 = 3.3V
  2-3 = 1.8V *
- (near JP3) DNI
- (near JP5) DNI
- Flex I/O Jumper
  1-2 = 3.3V
  2-3 = 1.8V *
- (near JP6) DNI
- VREG_DIG_1V8 Jumper
  1-2 = 1.9V - 4.2V
  2-3 = 1.8V *
- NOTE: VREG_DIG_1V8 capacitor
- (near JP7) DNI
- 1uF + 10 ohm or 1.9V - 4.2V VDD_MAIN operation
- 100nF for 1.8V VDD_MAIN operation
- (near R26) DNI
- DWG. NO.
- REV
- SHT
- REVISION
- DESCRIPTION
- DATE
- APPROVED
- ENG:
- APPROVALS
- PROJECT
- Suite 300
- Alif Semiconductor
- 7901 Stoneridge Drive
- DSN:
- CHK:
- REFERENCE DOCUMENTS
- TITLE
- Pleasanton, CA 94588  USA
- BOM:
- FAB DWG:
- PCB DWG:
- ASSY DWG:
- SCALE:
- SIZE
- B
- CAGE CODE
- FILE NAME
- DWG NO.
- SHEET
- OF
- none
- (in symbol SPARK_B1_120BGA_A5, part A) B Series BGA Power
- (in symbol SPARK_B1_120BGA_A5, part D) B Series BGA MIPI & USB

### Library data of the parts
C17 C19 = Cap: as C4 on sheet 2-PowerInput; Published: 8-Jun-2000; LatestRevisionDate: 17-Jul-2002; LatestRevisionNote: Re-released for DXP Platform.; PackageReference: RAD-0.3; Publisher: Altium Limited; PackageDescription: Radial Cap, Thru-Hole; 2 Leads; 0.3 in Pin Spacing; Max_Height: 0.60mm; Manufacturer 2: Samsung; Manufacturer Part Number 2: CL05A106MP5NUNC; Manufacturer 3: Venkel; Manufacturer Part Number 3: C0402X5R100-106MNP; Type: X5R; Voltage: 10V
C18 C20 C27 C28 C31 C32 = Cap: as C1 on sheet 2-PowerInput; Published: 8-Jun-2000; LatestRevisionDate: 17-Jul-2002; LatestRevisionNote: Re-released for DXP Platform.; PackageReference: RAD-0.3; Publisher: Altium Limited; PackageDescription: Radial Cap, Thru-Hole; 2 Leads; 0.3 in Pin Spacing; Max_Height: 0.60mm; Manufacturer 2: Yageo; Manufacturer Part Number 2: CC0402KRX5R8BB105; Manufacturer 3: Murata; Manufacturer Part Number 3: GRM155R61E105KA12D; Type: X5R; Voltage: 25V
C21 C22 C25 C26 C29 C30 C33 = Cap: Cap,100nF,10%,50V,X7R,0402; Manufacturer 1: TDK; Manufacturer Part Number 1: C1005X7R1H104K050BE; PCB_Footprint: CC0402; Published: 8-Jun-2000; LatestRevisionDate: 17-Jul-2002; LatestRevisionNote: Re-released for DXP Platform.; PackageReference: RAD-0.3; Publisher: Altium Limited; PackageDescription: Radial Cap, Thru-Hole; 2 Leads; 0.3 in Pin Spacing; Max_Height: 0.60mm; Manufacturer 2: Samsung; Manufacturer Part Number 2: CL05B104KB54PNC; Manufacturer 3: Walsin; Manufacturer Part Number 3: 0402B104K500CT; Type: X7R; Voltage: 50V
C23 = Cap: DNI,Cap,1.0uF,20%,25V,X5R,0402; Manufacturer 1: TDK; Manufacturer Part Number 1: CGB2A1X5R1E105K033BC; PCB_Footprint: CC0402; Published: 8-Jun-2000; LatestRevisionDate: 17-Jul-2002; LatestRevisionNote: Re-released for DXP Platform.; PackageReference: RAD-0.3; Publisher: Altium Limited; PackageDescription: Radial Cap, Thru-Hole; 2 Leads; 0.3 in Pin Spacing; Max_Height: 0.60mm; Manufacturer 2: Yageo; Manufacturer Part Number 2: CC0402KRX5R8BB105; Manufacturer 3: Murata; Manufacturer Part Number 3: GRM155R61E105KA12D; Type: X5R; Voltage: 25V
C24 = Cap_225M25VX5R0402_1: as C6 on sheet 2-PowerInput; Published: 8-Jun-2000; LatestRevisionDate: 17-Jul-2002; LatestRevisionNote: Re-released for DXP Platform.; PackageReference: RAD-0.3; Publisher: Altium Limited; PackageDescription: Radial Cap, Thru-Hole; 2 Leads; 0.3 in Pin Spacing; Max_Height: 0.60mm; Type: X5R; Voltage: 25V; Manufacturer 2: Murata; Manufacturer Part Number 2: GRM155R61E225ME11D; Manufacturer 3: Murata; Manufacturer Part Number 3: GRM155R61E225ME15D
C34 = Cap: as C2 on sheet 2-PowerInput; Published: 8-Jun-2000; LatestRevisionDate: 17-Jul-2002; LatestRevisionNote: Re-released for DXP Platform.; PackageReference: RAD-0.3; Publisher: Altium Limited; PackageDescription: Radial Cap, Thru-Hole; 2 Leads; 0.3 in Pin Spacing; Max_Height: 0.60mm; Manufacturer 2: Samsung; Manufacturer Part Number 2: CL05B103KB5NNNC; Manufacturer 3: Walsin; Manufacturer Part Number 3: 0402B103K500CT; Type: X7R; Voltage: 50V
C86 = Cap_225M25VX5R0402_1: Cap,4.7uF,20%,10V,X5R,0402; Manufacturer 1: TDK; Manufacturer Part Number 1: C1005X5R1A475K050BC; PCB_Footprint: CC0402; Published: 8-Jun-2000; LatestRevisionDate: 17-Jul-2002; LatestRevisionNote: Re-released for DXP Platform.; PackageReference: RAD-0.3; Publisher: Altium Limited; PackageDescription: Radial Cap, Thru-Hole; 2 Leads; 0.3 in Pin Spacing; Max_Height: 0.60mm; Type: X5R; Voltage: 10V; Manufacturer 2: Kyocera; Manufacturer Part Number 2: 0402YD475MAT2A; Manufacturer 3: Samsung; Manufacturer Part Number 3: CL05A475MP5NRNC
FB8 = Ind_WBC_1A5_120@100M0402_1: DNI,Ind,WidebandChoke,1.5A,120ohm@100MHz,95mOhm,0402; Manufacturer 1: Murata; Manufacturer Part Number 1: BLM15EG121SN1D; Code_IEC: 1005; DCR: 143m; Tolerance: 30%; Published: 8-Jun-2000; LatestRevisionDate: 29-May-2009; LatestRevisionNote: IPC-7351 Footprint Added.; PackageReference: 0402-A; Publisher: Altium Limited; PackageDescription: Chip Inductor; Code_JEITA: 0402; Sat_Current: *; Type: *; Manufacturer 2: *; Manufacturer Part Number 2: *; Manufacturer 3: *; Manufacturer Part Number 3: *; Max_Height: 0.60mm
FB9 = Res3: Res,10R0,1%,100ppm,0402; Manufacturer 1: Vishay; Manufacturer Part Number 1: CRCW040210R0FKED; Wattage: 63mW; Type: Thick Film; Published: 8-Jun-2000; LatestRevisionDate: 29-May-2009; LatestRevisionNote: IPC-7351 Footprint Added.; PackageReference: RESC0402-01; Publisher: Altium Limited; PackageDescription: Chip Resistor; Voltage: *; Manufacturer 2: KOA; Manufacturer Part Number 2: RK73H1ETTP10R0F; Manufacturer 3: Stackpol; Manufacturer Part Number 3: RMCF0402FT10R0; PCB_Footprint: RESC0402-01
FB12 = Ind_WBC_1A5_120@100M0402_1: as FB1 on sheet 2-PowerInput; Published: 8-Jun-2000; LatestRevisionDate: 29-May-2009; LatestRevisionNote: IPC-7351 Footprint Added.; PackageReference: 0402-A; Publisher: Altium Limited; PackageDescription: Chip Inductor; Code_JEITA: 0402; Sat_Current: *; Type: *; Manufacturer 2: *; Manufacturer Part Number 2: *; Manufacturer 3: *; Manufacturer Part Number 3: *; Max_Height: 0.60mm
JP1 JP2 JP4 JP5 = Hdr_M_1X2_2M54_STRT_UNSHROUD: DNI,Hdr, 0.025" SQ Post Header, Through-hole, Vertical, -55 to 125 degC, 2.54 mm Pitch, 2-Pin, Male, RoHS; Manufacturer: Samtec; Manufacturer Part Number 1: TSW-102-07-L-S; Pitch: 2.54 mm; ComponentLink3URL: http://www.samtec.com/documents/webfiles/cpdf/TSW-XXX-XX-XXX-X-XX-XXX-MKT.pdf; Temperature Range: -55 to 125 degC; DatasheetVersion: F-214; ComponentLink1Description: Manufacturer URL; ComponentLink2URL: http://www.samtec.com/documents/webfiles/pdf/TSW_TH.PDF; RoHS: True; Orientation: Vertical; ComponentLink2Description: Datasheet; ComponentLink3Description: Package Specification; PackageDescription: .025[0.64] SQ. Post Terminal Strip Assembly; Mounting Technology: Through-hole; PackageVersion: DM, 8/1988; ComponentLink1URL: http://www.samtec.com; PackageReference: *; PartNumber: *; Manufacturer 1: Samtec; Manufacturer 2: Amphenol; Manufacturer Part Number 2: 77311-102-02LF
JP3 JP6 JP7 = Hdr_M_1X3_2M54_STRT_UNSHROUD: DNI,Hdr, 0.025" SQ Post Header, Through-hole, Vertical, -55 to 125 degC, 2.54 mm Pitch, 3-Pin, Male, RoHS; Manufacturer: Samtec; Pitch: 2.54 mm; ComponentLink3URL: http://www.samtec.com/documents/webfiles/cpdf/TSW-XXX-XX-XXX-X-XX-XXX-MKT.pdf; Temperature Range: -55 to 125 degC; DatasheetVersion: F-214; ComponentLink1Description: Manufacturer URL; ComponentLink2URL: http://www.samtec.com/documents/webfiles/pdf/TSW_TH.PDF; RoHS: True; Orientation: Vertical; ComponentLink2Description: Datasheet; ComponentLink3Description: Package Specification; PackageDescription: .025[0.64] SQ. Post Terminal Strip Assembly; Mounting Technology: Through-hole; PackageVersion: DM, 8/1988; ComponentLink1URL: http://www.samtec.com; PackageReference: TSW-103-07-X-S; PartNumber: TSW-103-07-G-S; Manufacturer 1: Samtec; Manufacturer Part Number 1: TSW-103-07-G-S; Manufacturer 2: Sullins; Manufacturer Part Number 2: PRPC003SAAN-RC; Manufacturer 3: 3M; Manufacturer Part Number 3: 929647-01-03-I
L1 = Inductor: Ind,Unshielded,8.2nH,<5%,1.5A,<70mOhm, SRF > 4GHz, 0402; Manufacturer 1: Delta; Manufacturer Part Number 1: 0402HP-8N2EGTS; Published: 8-Jun-2000; LatestRevisionDate: 29-May-2009; LatestRevisionNote: IPC-7351 Footprint Added.; PackageReference: 0402; Publisher: Altium Limited; PackageDescription: Chip Inductor; Code_JEITA: 0402; Code_IEC: 0402; Sat_Current: *; Impedance: *; Type: *; Manufacturer 2: MuRata; Manufacturer Part Number 2: LQW15AN8N2G80D; Manufacturer 3: CoilCraft; Manufacturer Part Number 3: 0402DC-8N2XGRW; Max_Height: 0.70mm
L2 = Inductor: Ind,Shielded,Metal Comp,2.2uH,20%,1.8A,<140mOhm,0806(2016); Manufacturer 1: Samsung; Manufacturer Part Number 1: CIGT201610LH2R2MNE; Code_IEC: 2520; Published: 8-Jun-2000; LatestRevisionDate: 29-May-2009; LatestRevisionNote: IPC-7351 Footprint Added.; PackageReference: L1008; Publisher: Altium Limited; PackageDescription: Chip Inductor; Code_JEITA: 2520; Sat_Current: *; Impedance: *; Type: *; Manufacturer 2: Littlefuse; Manufacturer Part Number 2: LPWI201610H2R2T; Manufacturer 3: *; Manufacturer Part Number 3: *; Max_Height: 0.60mm
R17 = Res3: Res,1R00,1%,100ppm,0402; Manufacturer 1: Vishay; Manufacturer Part Number 1: CRCW04021R00FKED; Wattage: 63mW; Published: 8-Jun-2000; LatestRevisionDate: 29-May-2009; LatestRevisionNote: IPC-7351 Footprint Added.; PackageReference: RESC0402-01; Publisher: Altium Limited; PackageDescription: Chip Resistor; Voltage: *; Type: Thick Film; Manufacturer 2: KOA; Manufacturer Part Number 2: RK73H1ETTP1R00F; Manufacturer 3: Stackpol; Manufacturer Part Number 3: RMCF0402FT1R00; PCB_Footprint: RESC0402-01
R22 = Res3: as R10 on sheet 2-PowerInput; Published: 8-Jun-2000; LatestRevisionDate: 29-May-2009; LatestRevisionNote: IPC-7351 Footprint Added.; PackageReference: RESC0402-01; Publisher: Altium Limited; PackageDescription: Chip Resistor; Voltage: *; Type: Thick Film; Manufacturer 2: Yageo; Manufacturer Part Number 2: RC0402FR-071KL; Manufacturer 3: Bourns; Manufacturer Part Number 3: CR0402-FX-1001GLF; PCB_Footprint: RESC0402-01
R23 = Res3: Res,10R0,1%,100ppm,0402; Manufacturer 1: Vishay; Manufacturer Part Number 1: CRCW040210R0FKED; Wattage: 63mW; Published: 8-Jun-2000; LatestRevisionDate: 29-May-2009; LatestRevisionNote: IPC-7351 Footprint Added.; PackageReference: RESC0402-01; Publisher: Altium Limited; PackageDescription: Chip Resistor; Voltage: *; Type: Thick Film; Manufacturer 2: KOA; Manufacturer Part Number 2: RK73H1ETTP10R0F; Manufacturer 3: Stackpol; Manufacturer Part Number 3: RMCF0402FT10R0; PCB_Footprint: RESC0402-01
R24 = Res3: Res,1M00,1%,100ppm,0402; Manufacturer 1: Stackpol; Manufacturer Part Number 1: RMCF0402FT1M00; Wattage: 63mW; Published: 8-Jun-2000; LatestRevisionDate: 29-May-2009; LatestRevisionNote: IPC-7351 Footprint Added.; PackageReference: RESC0402-01; Publisher: Altium Limited; PackageDescription: Chip Resistor; Voltage: *; Type: Thick Film; Manufacturer 2: Yageo; Manufacturer Part Number 2: RC0402FR-071ML; Manufacturer 3: Bourns; Manufacturer Part Number 3: CR0402-FX-1004GLF; PCB_Footprint: RESC0402-01
R25 = Res3: Res,20K0,1%,100ppm,0402; Manufacturer 1: Stackpol; Manufacturer Part Number 1: RMCF0402FT20K0; Wattage: 63mW; Published: 8-Jun-2000; LatestRevisionDate: 29-May-2009; LatestRevisionNote: IPC-7351 Footprint Added.; PackageReference: RESC0402-01; Publisher: Altium Limited; PackageDescription: Chip Resistor; Voltage: *; Type: Thick Film; Manufacturer 2: Yageo; Manufacturer Part Number 2: RC0402FR-0720KL; Manufacturer 3: Bourns; Manufacturer Part Number 3: CR0402-FX-2002GLF; PCB_Footprint: RESC0402-01
R26 = Res3: DNI,Res,10K0,1%,100ppm,0402; Manufacturer 1: Stackpol; Manufacturer Part Number 1: RMCF0402FT10K0; Wattage: 63mW; Published: 8-Jun-2000; LatestRevisionDate: 29-May-2009; LatestRevisionNote: IPC-7351 Footprint Added.; PackageReference: RESC0402-01; Publisher: Altium Limited; PackageDescription: Chip Resistor; Voltage: *; Type: Thick Film; Manufacturer 2: Yageo; Manufacturer Part Number 2: RC0402FR-0710KL; Manufacturer 3: Bourns; Manufacturer Part Number 3: CR0402-FX-1002GLF; PCB_Footprint: RESC0402-01
R27 R28 = Res3: Res,200R,1%,100ppm,0402; Manufacturer 1: Stackpol; Manufacturer Part Number 1: RMCF0402FT220R; Wattage: 63mW; Published: 8-Jun-2000; LatestRevisionDate: 29-May-2009; LatestRevisionNote: IPC-7351 Footprint Added.; PackageReference: RESC0402-01; Publisher: Altium Limited; PackageDescription: Chip Resistor; Voltage: *; Type: Thick Film; Manufacturer 2: Yageo; Manufacturer Part Number 2: RC0402FR-07200RL; Manufacturer 3: Bourns; Manufacturer Part Number 3: CR0402-FX-2000GLF; PCB_Footprint: RESC0402-01
SH1-SH7 = SolderJumperShorted_Small: as S1 on sheet 2-PowerInput; Published: 8-Jun-2000; LatestRevisionDate: 29-May-2009; LatestRevisionNote: IPC-7351 Footprint Added.; PackageReference: J1-0603; Publisher: Altium Limited; PackageDescription: Chip Resistor; Voltage: *; Type: Thick Film; Manufacturer 1: *; Manufacturer Part Number 1: *; Manufacturer 2: *; Manufacturer Part Number 2: *; Manufacturer 3: *; Manufacturer Part Number 3: *; Tolerance: *; Value: *
TP12 = Hdr_M_1X1_2M54_STRT_UNSHROUD: DNI,Hdr, 0.025" SQ Post Header, Through-hole, Vertical, -55 to 125 degC, 2.54 mm Pitch, 1-Pin, Male, RoHS; Manufacturer: Samtec; Manufacturer Part Number 1: TSW-101-07-L-S; Pitch: 2.54 mm; ComponentLink3URL: http://www.samtec.com/documents/webfiles/cpdf/TSW-XXX-XX-XXX-X-XX-XXX-MKT.pdf; Temperature Range: -55 to 125 degC; DatasheetVersion: F-214; ComponentLink1Description: Manufacturer URL; ComponentLink2URL: http://www.samtec.com/documents/webfiles/pdf/TSW_TH.PDF; RoHS: True; Orientation: Vertical; ComponentLink2Description: Datasheet; ComponentLink3Description: Package Specification; PackageDescription: .025[0.64] SQ. Post Terminal Strip Assembly; Mounting Technology: Through-hole; PackageVersion: DM, 8/1988; ComponentLink1URL: http://www.samtec.com; PackageReference: *; PartNumber: *; Manufacturer 1: Samtec; Manufacturer 2: Amphenol; Manufacturer Part Number 2: 77311-101-01LF
TP13-TP18 = TP_SMPAD: as TP1 on sheet 2-PowerInput
U3 = SPARK_B1_120BGA_A5: IC,Alif Spark B1 MCU, Rev A5 silicon,BGA120; Manufacturer 1: Alif Semi; Manufacturer Part Number 1: AB1C1F4M51820PH0